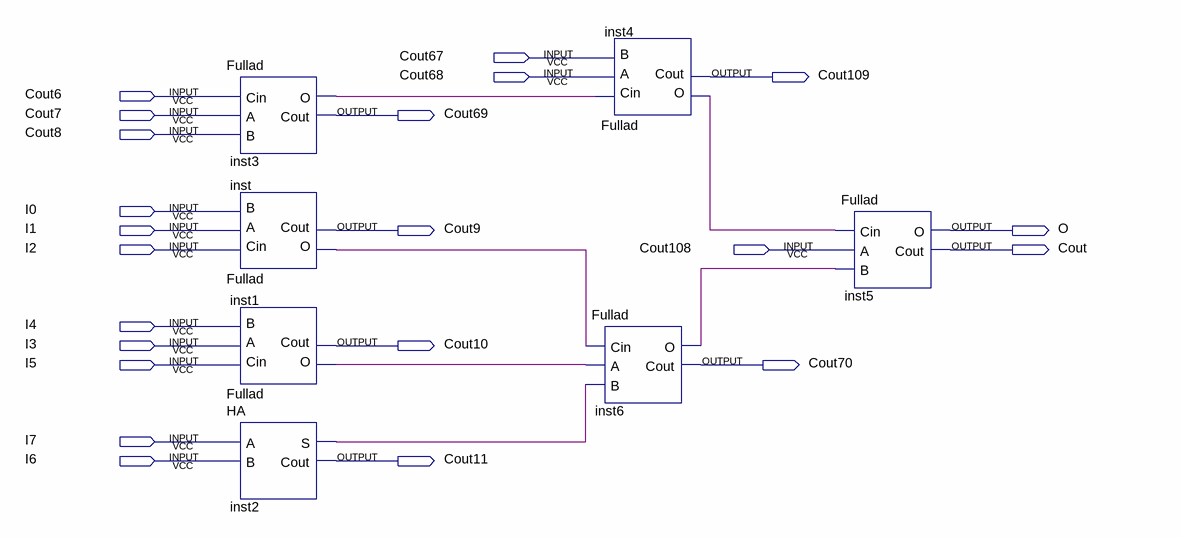
[diagram p0: schematic sheet]
// Quartus schematic B15.bdf as structural Verilog: 7 symbols, 22 pins
module B15 (
  input  Cout67,
  input  Cout68,
  input  Cout6,
  input  Cout7,
  input  Cout8,
  input  I0,
  input  I1,
  input  I2,
  input  Cout108,
  input  I4,
  input  I3,
  input  I5,
  input  I7,
  input  I6,
  output Cout109,
  output Cout69,
  output Cout9,
  output O,
  output Cout,
  output Cout10,
  output Cout70,
  output Cout11
);

  wire inst1_o, inst2_s, inst3_o, inst4_o, inst6_o, inst_o;

  Fullad inst3 (.Cin(Cout6), .A(Cout7), .B(Cout8), .O(inst3_o), .Cout(Cout69));
  Fullad inst (.Cin(I2), .A(I1), .B(I0), .O(inst_o), .Cout(Cout9));
  Fullad inst1 (.Cin(I5), .A(I3), .B(I4), .O(inst1_o), .Cout(Cout10));
  HA inst2 (.A(I7), .B(I6), .S(inst2_s), .Cout(Cout11));
  Fullad inst4 (.Cin(inst3_o), .A(Cout68), .B(Cout67), .O(inst4_o), .Cout(Cout109));
  Fullad inst6 (.Cin(inst_o), .A(inst1_o), .B(inst2_s), .O(inst6_o), .Cout(Cout70));
  Fullad inst5 (.Cin(inst4_o), .A(Cout108), .B(inst6_o), .O(O), .Cout(Cout));
endmodule
